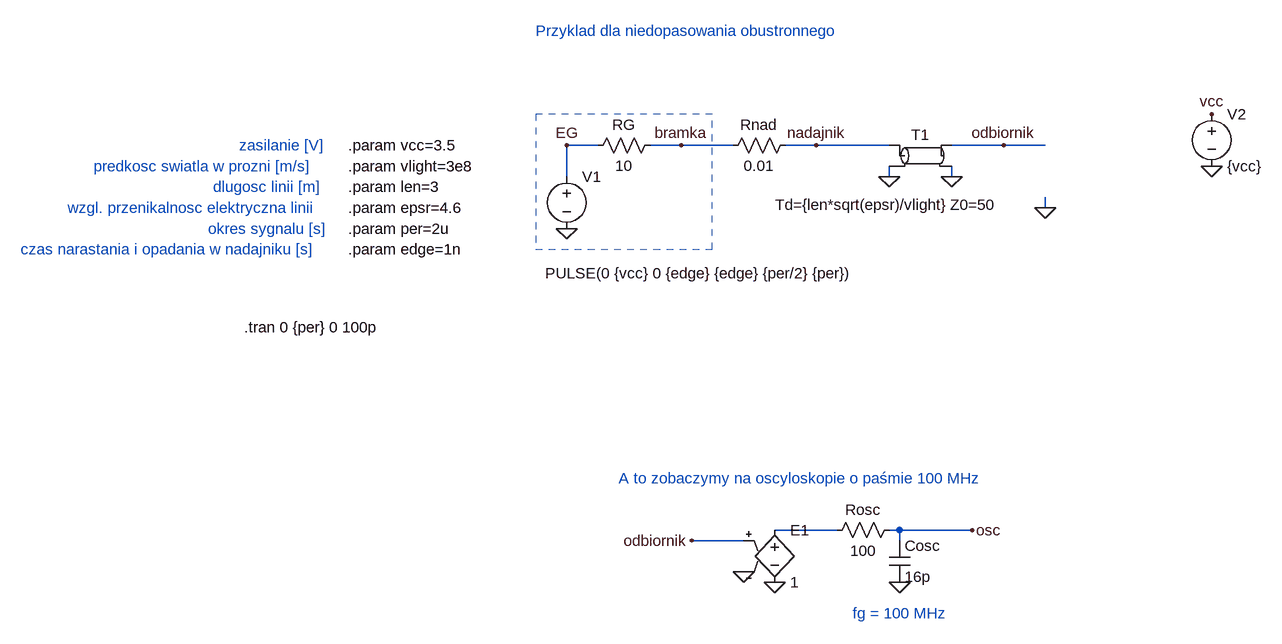
[diagram p0: schematic a.asc]
a.asc, the LTspice schematic file:
Version 4.1
SHEET 1 1236 880
WIRE -368 144 -416 144
WIRE -240 144 -288 144
WIRE -160 144 -240 144
WIRE -32 144 -80 144
WIRE 80 144 -32 144
WIRE 256 144 176 144
WIRE 320 144 256 144
WIRE -416 192 -416 144
WIRE 80 192 80 176
WIRE 176 192 176 176
WIRE 320 240 320 224
WIRE 0 736 -96 736
WIRE 96 736 80 736
WIRE 208 736 96 736
WIRE -144 752 -224 752
WIRE 96 752 96 736
FLAG 176 192 0
FLAG 80 192 0
FLAG -144 800 0
FLAG -96 816 0
FLAG 96 816 0
FLAG -416 272 0
FLAG 208 736 osc
FLAG 256 144 odbiornik
FLAG -224 752 odbiornik
FLAG -240 144 bramka
FLAG -416 144 EG
FLAG 320 240 0
FLAG -32 144 nadajnik
FLAG 576 176 0
FLAG 576 96 vcc
SYMBOL tline 128 160 R0
WINDOW 3 -51 60 Top 2
SYMATTR Value Td={len*sqrt(epsr)/vlight} Z0=50
SYMATTR InstName T1
SYMBOL e -96 720 R0
SYMATTR InstName E1
SYMATTR Value 1
SYMBOL res 96 720 R90
WINDOW 0 0 56 VBottom 2
WINDOW 3 32 56 VTop 2
SYMATTR InstName Rosc
SYMATTR Value 100
SYMBOL cap 80 752 R0
SYMATTR InstName Cosc
SYMATTR Value 16p
SYMBOL voltage -416 176 R0
WINDOW 123 0 0 Left 0
WINDOW 39 0 0 Left 0
WINDOW 3 -33 165 Left 2
SYMATTR Value PULSE(0 {vcc} 0 {edge} {edge} {per/2} {per})
SYMATTR InstName V1
SYMBOL res -384 160 R270
WINDOW 0 32 56 VTop 2
WINDOW 3 0 56 VBottom 2
SYMATTR InstName RG
SYMATTR Value 10
SYMBOL res -64 128 R90
WINDOW 0 0 56 VBottom 2
WINDOW 3 32 56 VTop 2
SYMATTR InstName Rnad
SYMATTR Value 0.01
SYMBOL voltage 576 80 R0
SYMATTR InstName V2
SYMATTR Value {vcc}
TEXT -912 424 Left 2 !.tran 0 {per} 0 100p
TEXT -752 272 Left 2 !.param per=2u
TEXT 24 864 Left 2 ;fg = 100 MHz
TEXT -752 304 Left 2 !.param edge=1n
TEXT -752 208 Left 2 !.param len=3
TEXT -752 144 Left 2 !.param vcc=3.5
TEXT -464 -32 Left 2 ;Przyklad dla niedopasowania obustronnego
TEXT -336 656 Left 2 ;A to zobaczymy na oscyloskopie o paśmie 100 MHz
TEXT -752 240 Left 2 !.param epsr=4.6
TEXT -752 176 Left 2 !.param vlight=3e8
TEXT -920 144 Left 2 ;zasilanie [V]
TEXT -1144 176 Left 2 ;predkosc swiatla w prozni [m/s]
TEXT -960 208 Left 2 ;dlugosc linii [m]
TEXT -1184 240 Left 2 ;wzgl. przenikalnosc elektryczna linii
TEXT -968 272 Left 2 ;okres sygnalu [s]
TEXT -1256 304 Left 2 ;czas narastania i opadania w nadajniku [s]
RECTANGLE Normal -192 96 -464 304 2

The netlist it stands for:
* a.asc
T1 nadajnik 0 odbiornik 0 Td={len*sqrt(epsr)/vlight} Z0=50
E1 N001 0 odbiornik 0 1
Rosc osc N001 100
Cosc osc 0 16p
V1 EG 0 PULSE(0 {vcc} 0 {edge} {edge} {per/2} {per})
RG EG bramka 10
Rnad nadajnik bramka 0.01
V2 vcc 0 {vcc}
.tran 0 {per} 0 100p
.param per=2u
* fg = 100 MHz
.param edge=1n
.param len=3
.param vcc=3.5
* Przyklad dla niedopasowania obustronnego
* A to zobaczymy na oscyloskopie o paśmie 100 MHz
.param epsr=4.6
.param vlight=3e8
* zasilanie [V]
* predkosc swiatla w prozni [m/s]
* dlugosc linii [m]
* wzgl. przenikalnosc elektryczna linii
* okres sygnalu [s]
* czas narastania i opadania w nadajniku [s]
.backanno
.end